# EAGLE design Mixer-Analog-OPA4134-Rev-L-multi (EAGLE 8.6.1)
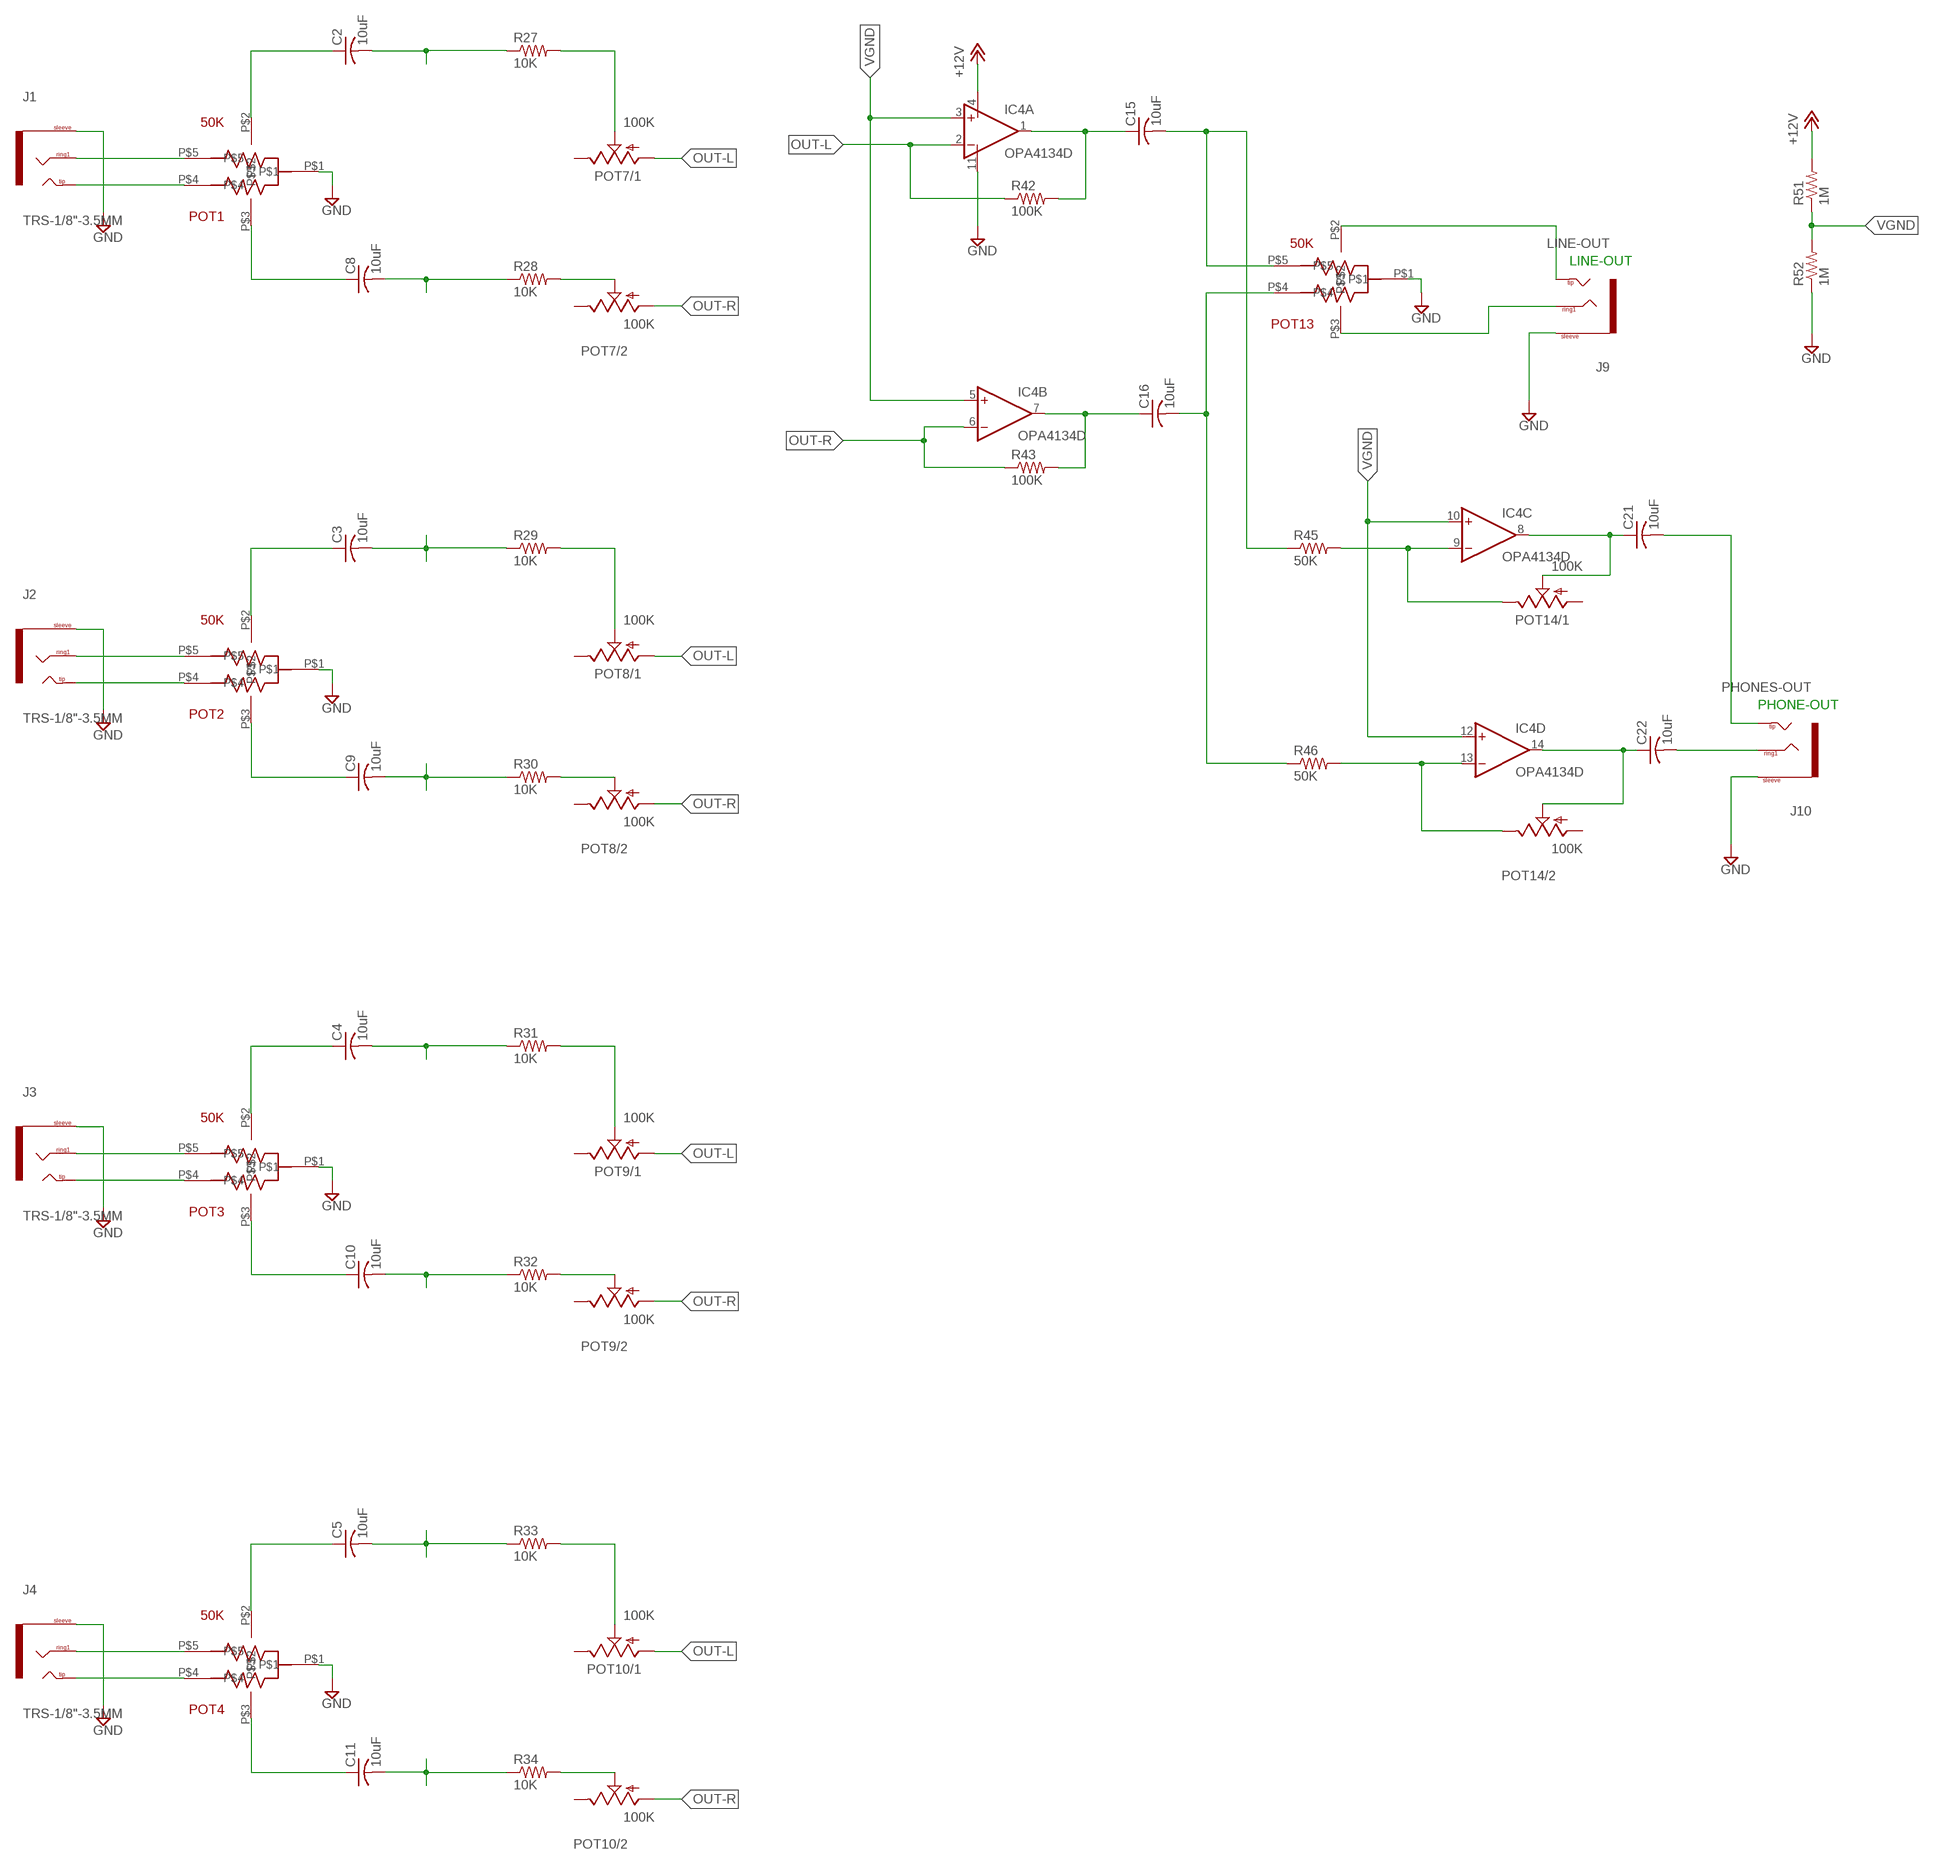
[diagram p0: schematic, sheet 1, part 1 of 2]
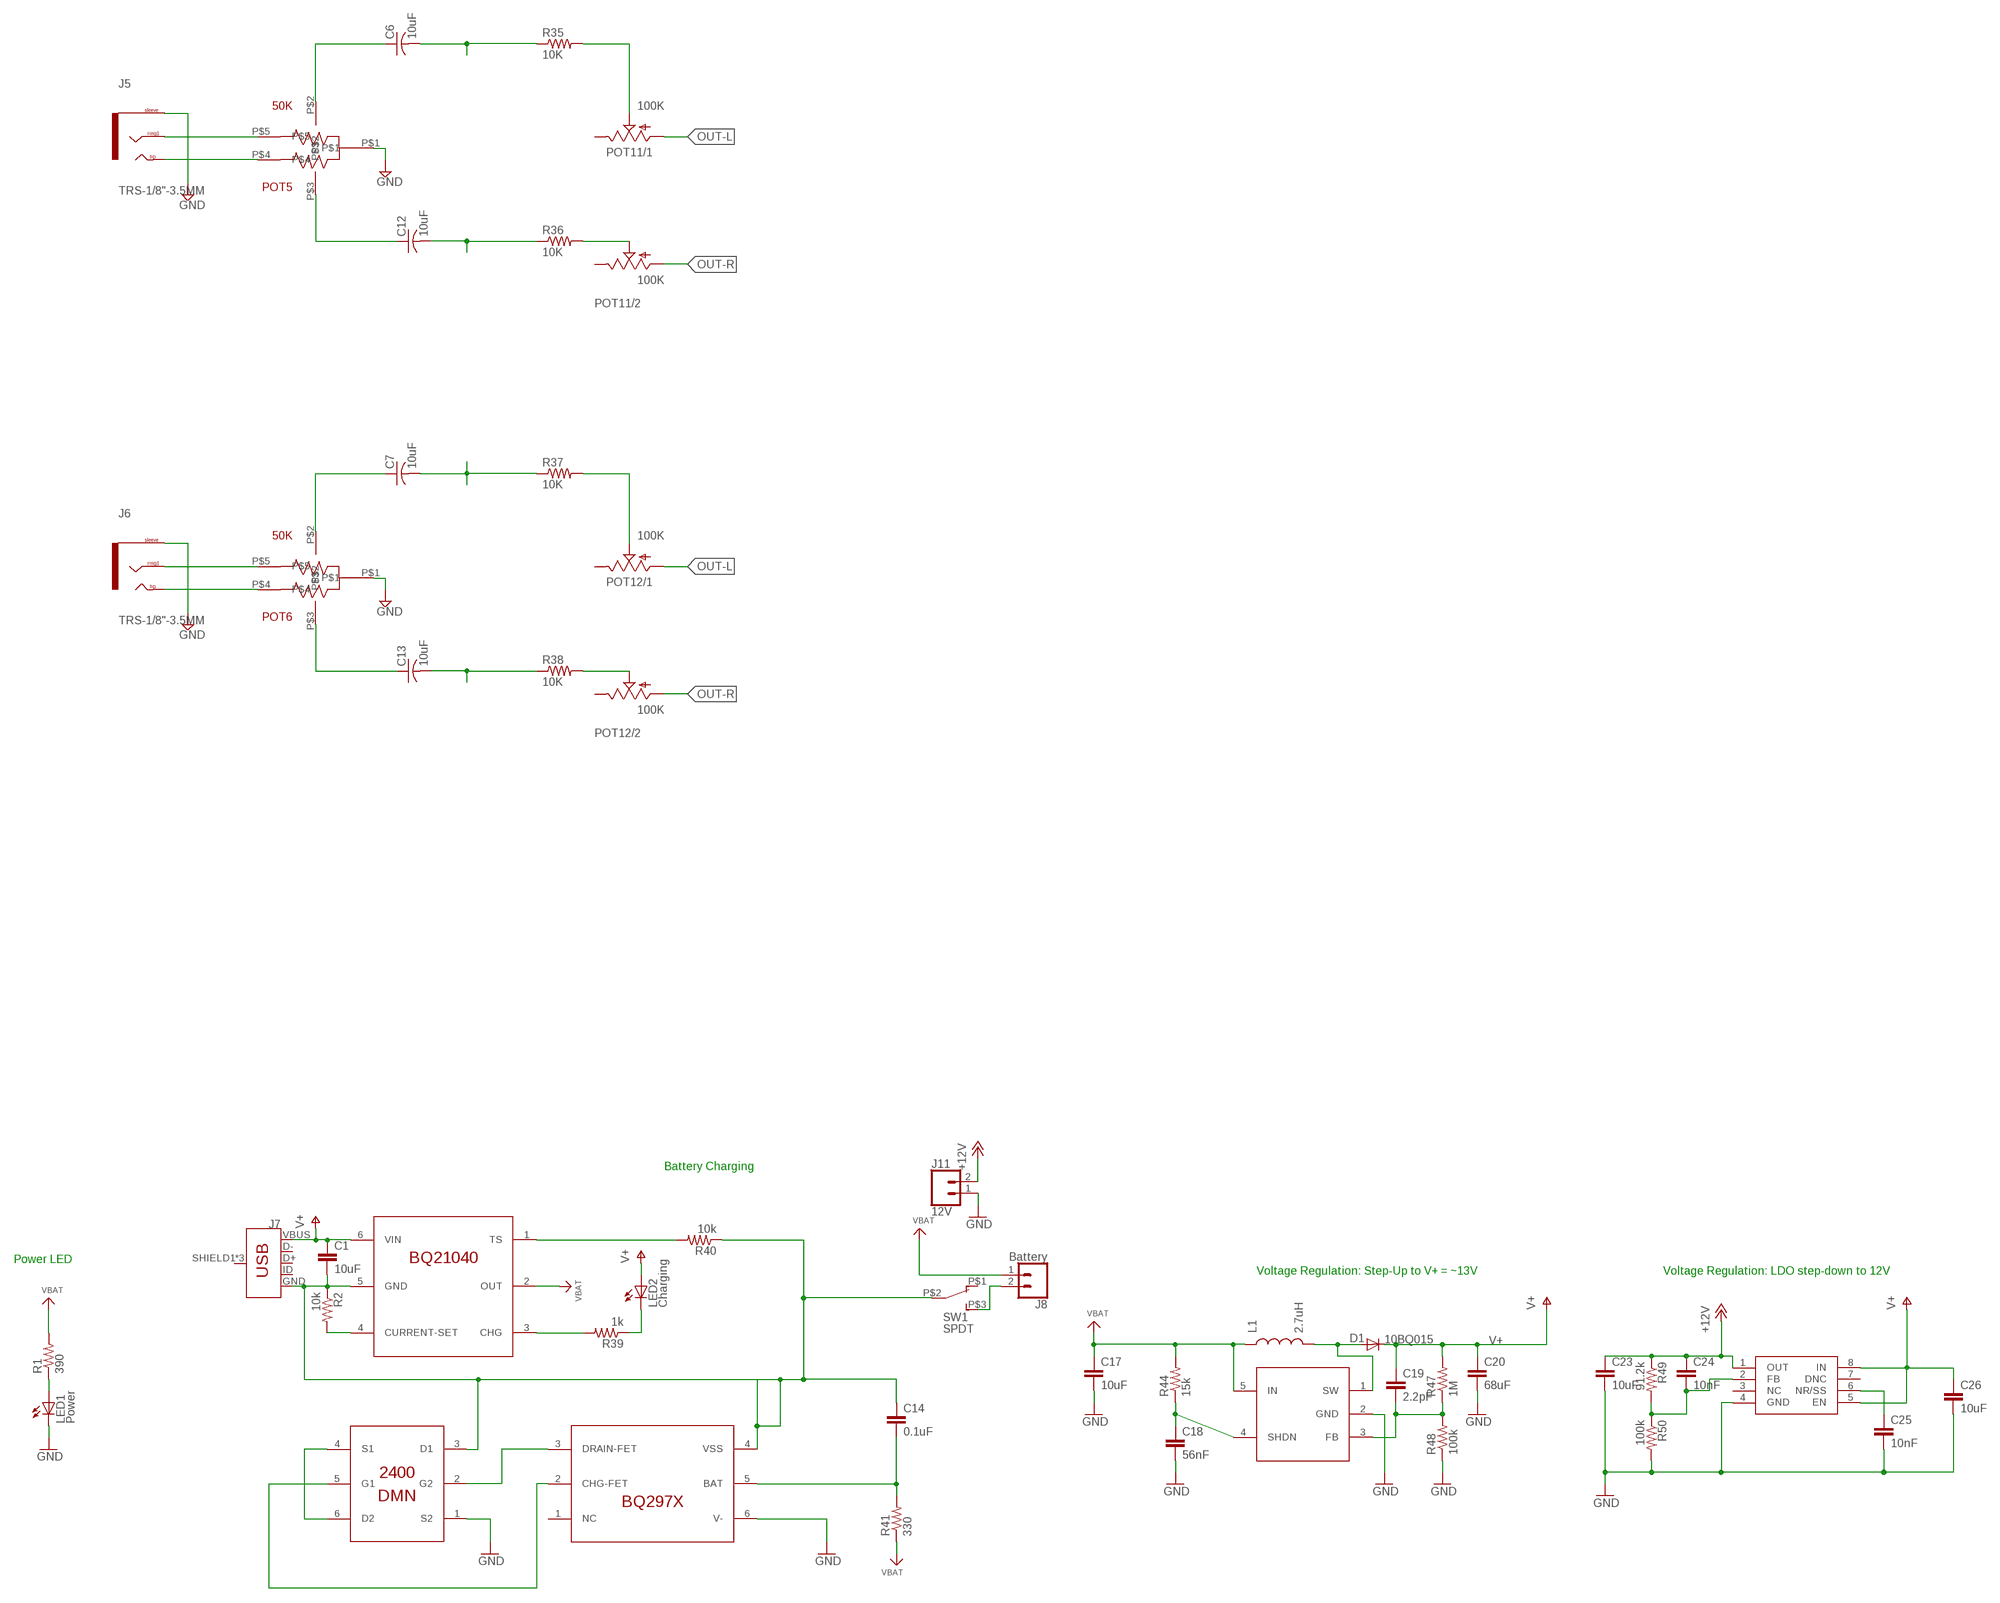
[diagram p1: schematic, sheet 1, part 2 of 2]

## Parts
C1  10uF  C-EUC0603  [C0603]
C2  10uF  C-USC0805K  [C0805K]
C3  10uF  C-USC0805K  [C0805K]
C4  10uF  C-USC0805K  [C0805K]
C5  10uF  C-USC0805K  [C0805K]
C6  10uF  C-USC0805K  [C0805K]
C7  10uF  C-USC0805K  [C0805K]
C8  10uF  C-USC0805K  [C0805K]
C9  10uF  C-USC0805K  [C0805K]
C10  10uF  C-USC0805K  [C0805K]
C11  10uF  C-USC0805K  [C0805K]
C12  10uF  C-USC0805K  [C0805K]
C13  10uF  C-USC0805K  [C0805K]
C14  0.1uF  C-EUC0603  [C0603]
C15  10uF  C-USC0805K  [C0805K]
C16  10uF  C-USC0805K  [C0805K]
C17  10uF  C-EUC0603  [C0603]
C18  56nF  C-EUC0603  [C0603]
C19  2.2pF  C-EUC0603  [C0603]
C20  68uF  C-EUC1206  [C1206]
C21  10uF  C-USC0805K  [C0805K]
C22  10uF  C-USC0805K  [C0805K]
C23  10uF  C-EUC0603  [C0603]
C24  10nF  C-EUC0603  [C0603]
C25  10nF  C-EUC0603  [C0603]
C26  10uF  C-EUC0603  [C0603]
D1  10BQ015  DIODESMA  [SMA-DIODE]
IC1  DMN2400  DUAL-NFET-DMN2400  [SOT-563]
IC2  BQ21040  BQ21040-LIPO-CHARGER  [SOT23-6]
IC3  BQ297X  BQ297X-BATTERY-MANAGER  [WSON-6]
IC4  OPA4134D  [SO14]
IC5  SC4503  [SOT23-5]
IC6  TPS7A49  [MSOP-8]
J1  TRS-1/8"-3.5MM  [TRS_SJ-3524-SMT]
J2  TRS-1/8"-3.5MM  [TRS_SJ-3524-SMT]
J3  TRS-1/8"-3.5MM  [TRS_SJ-3524-SMT]
J4  TRS-1/8"-3.5MM  [TRS_SJ-3524-SMT]
J5  TRS-1/8"-3.5MM  [TRS_SJ-3524-SMT]
J6  TRS-1/8"-3.5MM  [TRS_SJ-3524-SMT]
J7  USB_MICRO-BREDUCED_PASTE  [USB-B-MICRO-SMD_RED_PASTE]
J8  Battery  CONN_02LOCK  [1X02_LOCK]
J9  LINE-OUT  TRS-1/8"-3.5MM  [TRS_SJ-3524-SMT]
J10  PHONES-OUT  TRS-1/8"-3.5MM  [TRS_SJ-3524-SMT]
J11  12V  CONN_02LOCK  [1X02_LOCK]
L1  2.7uH  INDUCTORCR54-KIT  [CR54-KIT]
LED1  Power  LED3MM  [LED3MM]
LED2  Charging  LED3MM  [LED3MM]
POT1  50K  POT-DUAL-ALPS-RK10J12E0A0A  [POT-DUAL-ALPS-RK10J12E0A0A]
POT2  50K  POT-DUAL-ALPS-RK10J12E0A0A  [POT-DUAL-ALPS-RK10J12E0A0A]
POT3  50K  POT-DUAL-ALPS-RK10J12E0A0A  [POT-DUAL-ALPS-RK10J12E0A0A]
POT4  50K  POT-DUAL-ALPS-RK10J12E0A0A  [POT-DUAL-ALPS-RK10J12E0A0A]
POT5  50K  POT-DUAL-ALPS-RK10J12E0A0A  [POT-DUAL-ALPS-RK10J12E0A0A]
POT6  50K  POT-DUAL-ALPS-RK10J12E0A0A  [POT-DUAL-ALPS-RK10J12E0A0A]
POT7  100K  POT-DUAL-PTV112-4420  [PTV112]
POT8  100K  POT-DUAL-PTV112-4420  [PTV112]
POT9  100K  POT-DUAL-PTV112-4420  [PTV112]
POT10  100K  POT-DUAL-PTV112-4420  [PTV112]
POT11  100K  POT-DUAL-PTV112-4420  [PTV112]
POT12  100K  POT-DUAL-PTV112-4420  [PTV112]
POT13  50K  POT-DUAL-ALPS-RK10J12E0A0A  [POT-DUAL-ALPS-RK10J12E0A0A]
POT14  100K  POT-DUAL-PTV112-4420  [PTV112]
R1  390  R-US_R0603  [R0603]
R2  10k  R-US_R0603  [R0603]
R27  10K  RESISTOR0603-RES  [0603-RES]
R28  10K  RESISTOR0603-RES  [0603-RES]
R29  10K  RESISTOR0603-RES  [0603-RES]
R30  10K  RESISTOR0603-RES  [0603-RES]
R31  10K  RESISTOR0603-RES  [0603-RES]
R32  10K  RESISTOR0603-RES  [0603-RES]
R33  10K  RESISTOR0603-RES  [0603-RES]
R34  10K  RESISTOR0603-RES  [0603-RES]
R35  10K  RESISTOR0603-RES  [0603-RES]
R36  10K  RESISTOR0603-RES  [0603-RES]
R37  10K  RESISTOR0603-RES  [0603-RES]
R38  10K  RESISTOR0603-RES  [0603-RES]
R39  1k  R-US_R0603  [R0603]
R40  10k  R-US_R0603  [R0603]
R41  330  R-US_R0603  [R0603]
R42  100K  RESISTOR0603-RES  [0603-RES]
R43  100K  RESISTOR0603-RES  [0603-RES]
R44  15k  R-US_R0603  [R0603]
R45  50K  RESISTOR0603-RES  [0603-RES]
R46  50K  RESISTOR0603-RES  [0603-RES]
R47  1M  R-US_R0603  [R0603]
R48  100k  R-US_R0603  [R0603]
R49  91.2k  R-US_R0603  [R0603]
R50  100k  R-US_R0603  [R0603]
R51  1M  RESISTOR0603-RES  [0603-RES]
R52  1M  RESISTOR0603-RES  [0603-RES]
SW1  SPDT  SWITCH_SPDTCL-SB-12B  [SWITCH_SPDT_CL-SB-12B]

## Nets
+12V: C23.1 C24.1 IC4.4(P:V+) IC6.1(OUT) J11.2 R49.1 R51.2
GND: C17.2 C18.2 C20.2 C23.2 C25.2 C26.2 IC1.1(S2) IC3.6(V-) IC4.11(P:V-) IC6.4(GND) J1.1(SLEEVE) J2.1(SLEEVE) J3.1(SLEEVE) J4.1(SLEEVE) J5.1(SLEEVE) J6.1(SLEEVE) J9.1(SLEEVE) J10.1(SLEEVE) J11.1 LED1.K(C) POT1.P$1 POT2.P$1 POT3.P$1 POT4.P$1 POT5.P$1 POT6.P$1 POT13.P$1 R48.1 R50.2 R52.1
GND1: C1.2 C14.1 IC1.3(D1) IC2.5(GND) IC3.4(VSS) J7.GND R2.1 R40.1 SW1.P$2
N$1: C8.1 POT1.P$3
N$2: J8.2 SW1.P$3
N$3: C8.2 R28.1
N$5: J1.3(RING1) POT1.P$5
N$7: C15.1 IC4.1(A:OUT) R42.2
N$8: C2.1 POT1.P$2
N$9: J1.2(TIP) J1.4(TIP) POT1.P$4
N$13: C2.2 R27.1
N$15: IC4.13(D:-IN) POT14.2.3(/2:E) R46.2
N$16: J9.2(TIP) J9.4(TIP) POT13.P$2
N$17: C16.1 IC4.7(B:OUT) R43.2
N$18: J9.3(RING1) POT13.P$3
N$19: POT7.2.2(/2:S) R28.2
N$21: C22.2 J10.3(RING1)
N$22: C9.2 R30.1
N$23: C21.2 J10.2(TIP) J10.4(TIP)
N$24: C21.1 IC4.8(C:OUT) POT14.1.2(/1:S)
N$25: C22.1 IC4.14(D:OUT) POT14.2.2(/2:S)
N$26: J2.3(RING1) POT2.P$5
N$27: POT8.1.2(/1:S) R29.2
N$28: C9.1 POT2.P$3
N$29: C3.1 POT2.P$2
N$30: J2.2(TIP) J2.4(TIP) POT2.P$4
N$31: C3.2 R29.1
N$32: POT8.2.2(/2:S) R30.2
N$41: C10.2 R32.1
N$42: J3.3(RING1) POT3.P$5
N$43: POT9.1.2(/1:S) R31.2
N$44: C10.1 POT3.P$3
N$45: C4.1 POT3.P$2
N$46: J3.2(TIP) J3.4(TIP) POT3.P$4
N$47: C4.2 R31.1
N$48: POT9.2.2(/2:S) R32.2
N$55: POT7.1.2(/1:S) R27.2
N$58: C11.2 R34.1
N$59: J4.3(RING1) POT4.P$5
N$60: POT10.1.2(/1:S) R33.2
N$61: C15.2 POT13.P$5 R45.1
N$62: C11.1 POT4.P$3
N$63: C5.1 POT4.P$2
N$64: J4.2(TIP) J4.4(TIP) POT4.P$4
N$65: C5.2 R33.1
N$66: POT10.2.2(/2:S) R34.2
N$75: C12.2 R36.1
N$76: J5.3(RING1) POT5.P$5
N$77: POT11.1.2(/1:S) R35.2
N$78: C12.1 POT5.P$3
N$79: C6.1 POT5.P$2
N$80: J5.2(TIP) J5.4(TIP) POT5.P$4
N$81: C6.2 R35.1
N$82: POT11.2.2(/2:S) R36.2
N$91: C13.2 R38.1
N$92: J6.3(RING1) POT6.P$5
N$93: POT12.1.2(/1:S) R37.2
N$94: C13.1 POT6.P$3
N$95: C7.1 POT6.P$2
N$96: J6.2(TIP) J6.4(TIP) POT6.P$4
N$97: C7.2 R37.1
N$98: POT12.2.2(/2:S) R38.2
N$114: LED1.A R1.1
N$115: D1.A IC5.1(SW) L1.P$2
N$116: C18.1 IC5.4(SHDN) R44.1
N$117: C19.2 IC5.3(FB) R47.1 R48.2
N$118: C24.2 IC6.2(FB) R49.2 R50.1
N$119: C25.1 IC6.6(NR/SS)
N$121: LED2.K(C) R39.1
N$122: IC2.3(CHG) R39.2
N$123: IC2.1(TS) R40.2
N$124: IC2.4(CURRENT-SET) R2.2
N$125: C14.2 IC3.5(BAT) R41.2
N$126: IC1.4(S1) IC1.6(D2)
N$127: IC1.5(G1) IC3.2(CHG-FET)
N$128: IC1.2(G2) IC3.3(DRAIN-FET)
OUT-L: IC4.2(A:-IN) POT7.1.1(/1:A) POT8.1.1(/1:A) POT9.1.1(/1:A) POT10.1.1(/1:A) POT11.1.1(/1:A) POT12.1.1(/1:A) R42.1
OUT-L1: IC4.9(C:-IN) POT14.1.3(/1:E) R45.2
OUT-R: IC4.6(B:-IN) POT7.2.1(/2:A) POT8.2.1(/2:A) POT9.2.1(/2:A) POT10.2.1(/2:A) POT11.2.1(/2:A) POT12.2.1(/2:A) R43.1
OUT-R1: C16.2 POT13.P$4 R46.1
V+: C1.1 C19.1 C20.1 C26.1 D1.C IC2.6(VIN) IC6.5(EN) IC6.8(IN) J7.VBUS LED2.A R47.2
VBAT: C17.1 IC2.2(OUT) IC5.5(IN) J8.1 L1.P$1 R1.2 R41.1 R44.2
VGND: IC4.3(A:+IN) IC4.5(B:+IN) IC4.10(C:+IN) IC4.12(D:+IN) R51.1 R52.2
Unconnected: IC3.1(NC) IC5.2(GND) IC6.3(NC) IC6.7(DNC) J7.D+ J7.D- J7.ID J7.SHIELD1(SHIELD) J7.SHIELD2(SHIELD) J7.SHIELD3(SHIELD) POT7.1.3(/1:E) POT7.2.3(/2:E) POT8.1.3(/1:E) POT8.2.3(/2:E) POT9.1.3(/1:E) POT9.2.3(/2:E) POT10.1.3(/1:E) POT10.2.3(/2:E) POT11.1.3(/1:E) POT11.2.3(/2:E) POT12.1.3(/1:E) POT12.2.3(/2:E) POT14.1.1(/1:A) POT14.2.1(/2:A) SW1.P$1

## Notes on the sheet
- LINE-OUT
- PHONE-OUT
- Battery Charging
- Power LED
- Voltage Regulation: Step-Up to V+ = ~13V | Voltage Regulation: LDO step-down to 12V

## Library data of the parts
C1 C14 C17-C20 C23-C26 = rcl:C-EU: CAPACITOR, European symbol; SPICEPREFIX: C
C2-C13 C15 C16 C21 C22 = adafruit:C-US: CAPACITOR, American symbol
D1 = SparkFun:DIODE: Diode These are standard reverse protection diodes and small signal diodes. SMA package can handle up to about 1A. SOD-323 can handle about 200mA. What the SOD-323 package when ordering, there are some mfgs out there that are 5-pin packages.
IC1 = CMU-ArtFab:DUAL-NFET-DMN2400
IC2 = CMU-ArtFab:BQ21040-LIPO-CHARGER
IC3 = CMU-ArtFab:BQ297X-BATTERY-MANAGER
IC4 = linear:OPA4134: SoundPLUS (TM) High Performance AUDIO OPERATIONAL AMPLIFIERS Source: http://focus.ti.com/lit/ds/sbos058/sbos058.pdf
IC5 = CMU-ArtFab:SC4503
IC6 = CMU-ArtFab:TPS7A49
J1-J6 J9 J10 = CMU-ArtFab:TRS-1/8"-3.5MM
J7 = SparkFun-Connectors:USB_MICRO-B: USB Type Micro-B Connector Male/female and PTH/SMT variants SparkFun Products: SparkFun microB USB Breakout <https://www.sparkfun.com/products/12035> SparkFun USB microB Plug Breakout <https://www.sparkfun.com/products/10031> SparkFun ESP8266 Thing <https://www.sparkfun.com/products/13231>; PROD_ID: CONN-11752
J8 J11 = SparkFun-Connectors:CONN_02: Multi connection point. Often used as Generic Header-pin footprint for 0.1 inch spaced/style header connections On any of the 0.1 inch spaced packages, you can populate with these: Break Away Headers - Straight <https://www.sparkfun.com/products/116> (PRT-00116) Break Away Male Headers - Right Angle <https://www.sparkfun.com/products/553> (PRT-00553) Female Headers <https://www.sparkfun.com/products/115> (PRT-00115) Break Away Headers - Machine Pin <https://www.sparkfun.com/products/117> (PRT-00117) Break Away Female Headers - Swiss Machine Pin <https://www.sparkfun.com/products/743> (PRT-00743) For SCREWTERMINALS and SPRING TERMINALS visit here: Screw Terimnals on SparkFun.com <https://www.sparkfun.com/search/results?term=Screw+Terminals> (5mm/3.5mm/2.54mm spacing) This device is also useful as a general connection point to wire up your design to another part of your project. Our various solder wires solder well into these plated through hole pads. Hook-Up Wire - Assortment (Stranded, 22 AWG) <https://www.sparkfun.com/products/11375> (PRT-11375) Hook-Up Wire - Assortment (Solid Core, 22 AWG) <https://www.sparkfun.com/products/11367> (PRT-11367) View the entire wire category on our website here <https://www.sparkfun.com/categories/141> Special notes: Molex polarized connector foot print use with: PRT-08233 with associated crimp pins and housings. 2.54_SCREWTERM for use with PRT-10571. 3.5mm Screw Terminal footprints for PRT-08084 5mm Screw Terminal footprints for use with PRT-08432
L1 = SparkFun-Passives:INDUCTOR: Inductors Basic Inductor/Choke - 0603 and 1206. Footprints are not proven and vary greatly between part numbers. SRN6045- 33uH, 20% 1.4A SDR0403-560KL - 56uH, 10%, 500mA RMS/740mA peak
LED1 LED2 = led:LED: LED OSRAM: - CHIPLED LG R971, LG N971, LY N971, LG Q971, LY Q971, LO R971, LY R971 LH N974, LH R974 LS Q976, LO Q976, LY Q976 LO Q996 - Hyper CHIPLED LW Q18S LB Q993, LB Q99A, LB R99A - SideLED LS A670, LO A670, LY A670, LG A670, LP A670 LB A673, LV A673, LT A673, LW A673 LH A674 LY A675 LS A676, LA A676, LO A676, LY A676, LW A676 LS A679, LY A679, LG A679 - Hyper Micro SIDELED® LS Y876, LA Y876, LO Y876, LY Y876 LT Y87S - SmartLED LW L88C, LW L88S LB L89C, LB L89S, LG L890 LS L89K, LO L89K, LY L89K LS L896, LA L896, LO L896, LY L896 - TOPLED LS T670, LO T670, LY T670, LG T670, LP T670 LSG T670, LSP T670, LSY T670, LOP T670, LYG T670 LG T671, LOG T671, LSG T671 LB T673, LV T673, LT T673, LW T673 LH T674 LS T676, LA T676, LO T676, LY T676, LB T676, LH T676, LSB T676, LW T676 LB T67C, LV T67C, LT T67C, LS T67K, LO T67K, LY T67K, LW E67C LS E67B, LA E67B, LO E67B, LY E67B, LB E67C, LV E67C, LT E67C LW T67C LS T679, LY T679, LG T679 LS T770, LO T770, LY T770, LG T770, LP T770 LB T773, LV T773, LT T773, LW T773 LH T774 LS E675, LA E675, LY E675, LS T675 LS T776, LA T776, LO T776, LY T776, LB T776 LHGB T686 LT T68C, LB T68C - Hyper Mini TOPLED® LB M676 - Mini TOPLED Santana® LG M470 LS M47K, LO M47K, LY M47K Source: http://www.osram.convergy.de LUXEON: - LUMILED® LXK2-PW12-R00, LXK2-PW12-S00, LXK2-PW14-U00, LXK2-PW14-V00 LXK2-PM12-R00, LXK2-PM12-S00, LXK2-PM14-U00 LXK2-PE12-Q00, LXK2-PE12-R00, LXK2-PE12-S00, LXK2-PE14-T00, LXK2-PE14-U00 LXK2-PB12-K00, LXK2-PB12-L00, LXK2-PB12-M00, LXK2-PB14-N00, LXK2-PB14-P00, LXK2-PB14-Q00 LXK2-PR12-L00, LXK2-PR12-M00, LXK2-PR14-Q00, LXK2-PR14-R00 LXK2-PD12-Q00, LXK2-PD12-R00, LXK2-PD12-S00 LXK2-PH12-R00, LXK2-PH12-S00 LXK2-PL12-P00, LXK2-PL12-Q00, LXK2-PL12-R00 Source: www.luxeon.com KINGBRIGHT: KA-3528ASYC Source: www.kingbright.com
POT1-POT6 POT13 = CMU-ArtFab:POT-DUAL-ALPS-RK10J12E0A0A
POT7-POT12 POT14 = CMU-ArtFab:POT-DUAL-PTV112: Bourns 11mm dual potentiometer; AVAILABILITY: Unavailable; DESCRIPTION: Alt# Tce-10111410; MF: STMicroelectronics; MP: PTV112; PACKAGE: None; PRICE: None; SPICEPREFIX: J
R1 R2 R39-R41 R44 R47-R50 = CMU-ArtFab:R-US_: RESISTOR, American symbol
R27-R38 R42 R43 R45 R46 = SparkFun-Passives:RESISTOR: Resistor Basic schematic elements and footprints for 0603, 1206, and PTH resistors.; SPICEPREFIX: R
R51 R52 = SparkFun-Passives:RESISTOR: Resistor Basic schematic elements and footprints for 0603, 1206, and PTH resistors.
SW1 = CMU-ArtFab:SWITCH_SPDT

## Board
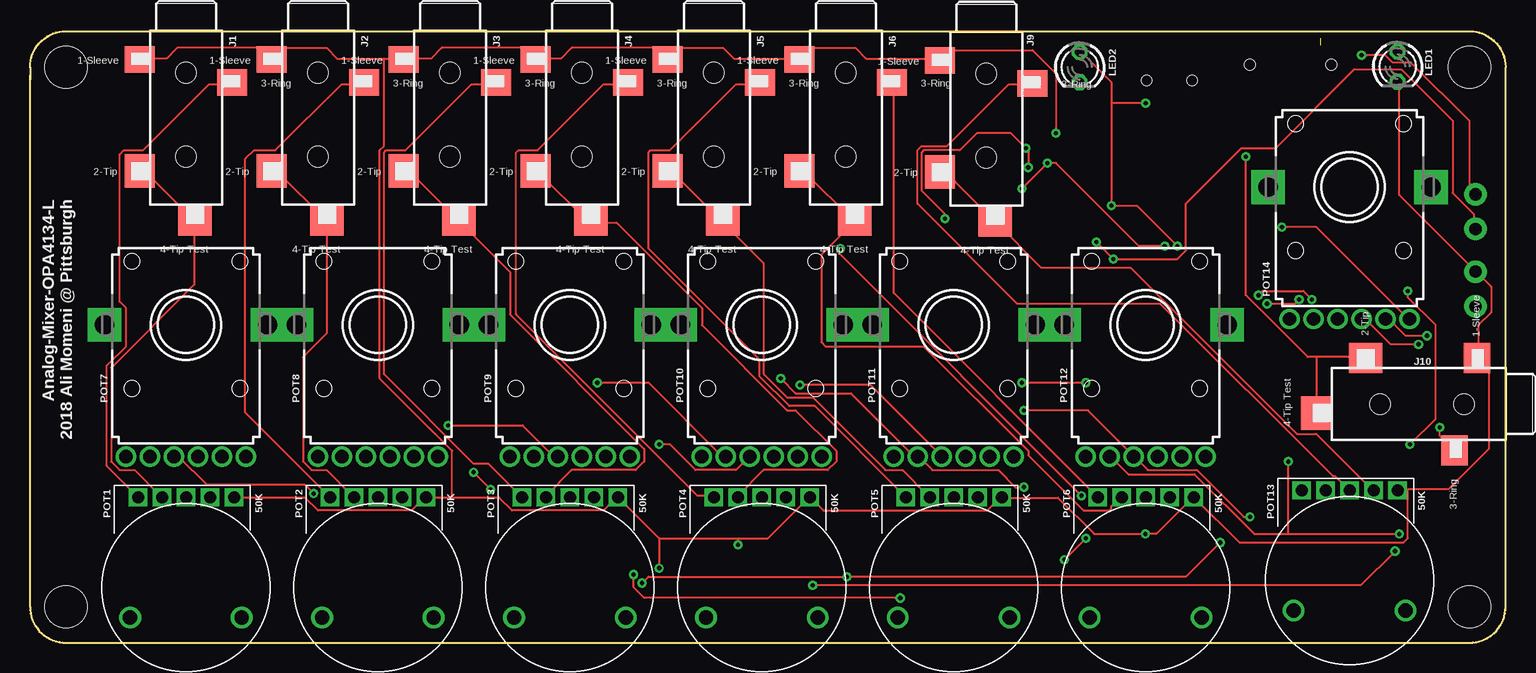
[diagram p2: board, top side]
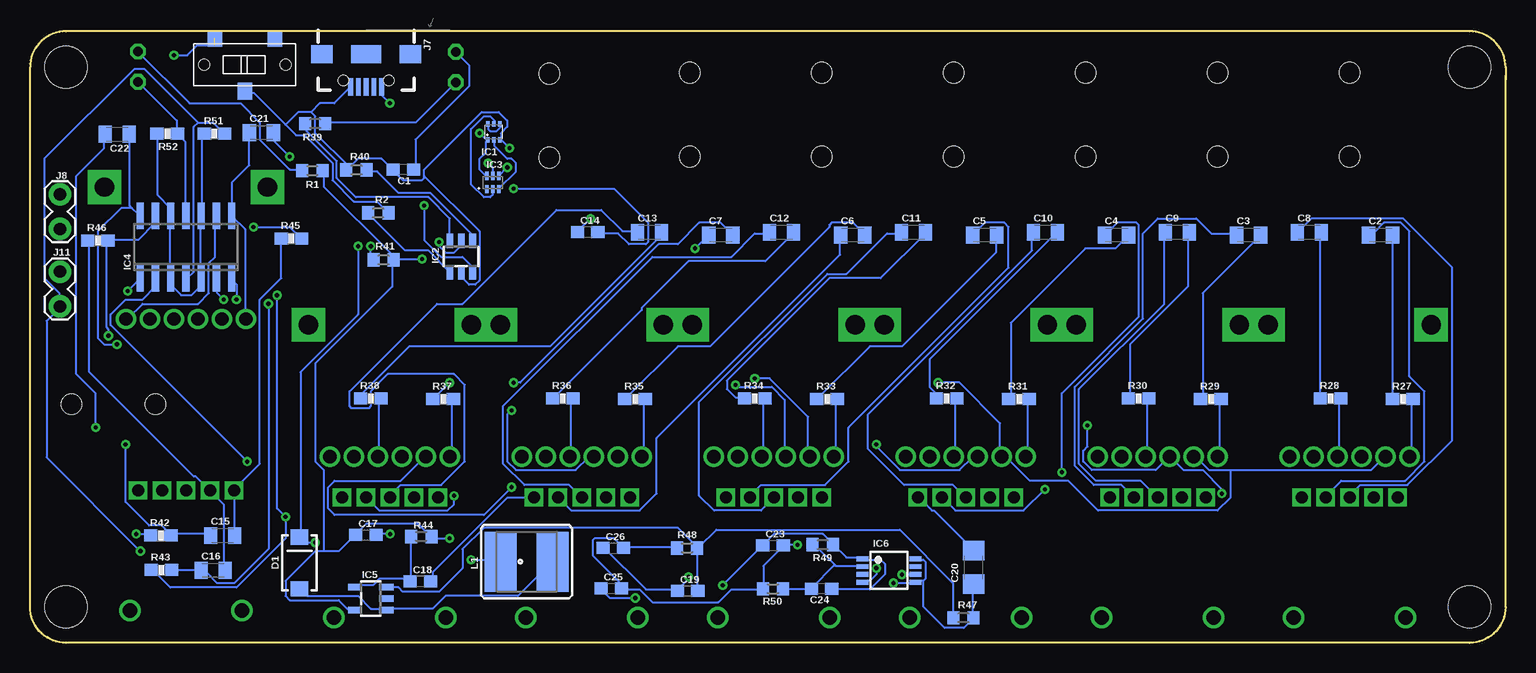
[diagram p3: board, bottom side, seen from below]

Size 123 x 51 mm. Coordinates in mm from the lower left corner, seen from the top.
Outline: 0,47 0,47.3
Outline: 0,47 0,48 arc-90 3,51 120,51 arc-90 123,48 123,3 arc-90 120,0 3,0 arc-90 0,3 0,47
Copper layers (1*16): Top 0.035mm / dielectric 1.5mm / Bottom 0.035mm
Design rules "default *": minimum track width 6mil, minimum drill 0.35mm, track to track 8mil, track to pad 8mil, pad to pad 8mil, via to via 8mil, smd to smd 8mil, copper to edge 40mil, drill to drill 6mil, minimum pad ring 10mil, minimum via ring 8mil, stop-mask expansion 4mil, vias tented up to drill 0mil, thermal gap 10mil
Holes 3.5 mm at 3,48 3,3 120,3 120,48

### Footprints (pad centres in the part's own frame; a part is rotated, then mirrored left to right if it is on the bottom)
C0603 = smd 1.1 x 1: 1 -0.85,0; 2 0.85,0
C0805K = smd 1.1 x 1.4: 1 -1,0; 2 1,0
C1206 = smd 1.6 x 1.8: 1 -1.4,0; 2 1.4,0
SMA-DIODE = smd 1.27 x 1.47: A -2.15,0; C 2.15,0
SOT-563 = smd 0.3 x 0.45: 1 -0.5,-0.675; 2 0,-0.675; 3 0.5,-0.675; 4 0.5,0.675; 5 0,0.675; 6 -0.5,0.675
SOT23-6 = smd 0.55 x 1.2: 1 -0.95,-1.3; 2 0,-1.3; 3 0.95,-1.3; 4 0.95,1.3; 5 0,1.3; 6 -0.95,1.3
WSON-6 = smd 0.3 x 0.7: 1 -0.5,-0.55; 2 0,-0.55; 3 0.5,-0.55; 4 0.5,0.55; 5 0,0.55; 6 -0.5,0.55
SO14 = smd 0.6 x 2.2: 1 -3.81,-2.6; 2 -2.54,-2.6; 3 -1.27,-2.6; 4 0,-2.6; 5 1.27,-2.6; 6 2.54,-2.6; 7 3.81,-2.6; 8 3.81,2.6; 9 2.54,2.6; 10 1.27,2.6; 11 0,2.6; 12 -1.27,2.6; 13 -2.54,2.6; 14 -3.81,2.6
SOT23-5 = smd 0.55 x 1.2: 1 -0.95,-1.3; 2 0,-1.3; 3 0.95,-1.3; 4 0.95,1.3; 5 -0.95,1.3
MSOP-8 = smd 0.4 x 1: 1 -0.975,-2.2; 2 -0.325,-2.2; 3 0.325,-2.2; 4 0.975,-2.2; 5 0.975,2.2; 6 0.325,2.2; 7 -0.325,2.2; 8 -0.975,2.2
TRS_SJ-3524-SMT = smd 2.5 x 2.2: 1 3.85,-4.6; 3 -3.85,-2.7 | smd 2.5 x 2.8: 2 3.85,4.7 | smd 2.8 x 2.5: 4 -0.75,8.85 | hole 1.7: 0,-3.5; 0,3.5
USB-B-MICRO-SMD_RED_PASTE = smd 1.45 x 0.4: D+ 2.725,0; D- 2.725,0.65; GND 2.725,-1.3; ID 2.725,-0.65; VBUS 2.725,1.3 | smd 1.5 x 1.8: SHIELD1 0,3.685; SHIELD2 0,-3.685 | smd 1.5 x 2.5: SHIELD3 0,0 | hole 0.85: 2.2,1.9; 2.2,-1.9
1X02_LOCK = drill 1.016 pad 1.88: 1 -0.178,0; 2 2.718,0
CR54-KIT = smd 5 x 2.65: P$1 0,2.17; P$2 0,-2.17
LED3MM = drill 0.813 octagon: A -1.27,0; K 1.27,0
POT-DUAL-ALPS-RK10J12E0A0A = drill 1 pad 1.321 square: P$1 -4,0; P$2 -2,0; P$3 0,0; P$4 2,0; P$5 4,0 | drill 1.2: P$6 4.65,10; P$7 -4.65,10
PTV112 = drill 1.1 pad 1.676: 1.1 -3,-11; 1.2 -5,-11; 1.3 5,-11; 2.1 -1,-11; 2.2 1,-11; 2.3 3,-11 | drill 1.6 pad 2.8 square: M1 -6.8,0; M2 6.8,0
R0603 = smd 1 x 1.1: 1 -0.85,0; 2 0.85,0
0603-RES = smd 1.1 x 1: 1 -0.85,0; 2 0.85,0
SWITCH_SPDT_CL-SB-12B = smd 1.2 x 1.4: P$1 -2.5,-2.2; P$2 0,2.2; P$3 2.5,-2.2 | hole 0.9: -3.4,0; 3.4,0

### Placement (x,y rotation side)
C1  91.88,39.46 180 bottom
C2  10.42,34 0 bottom
C3  21.42,34 0 bottom
C4  32.42,34 0 bottom
C5  43.42,34 0 bottom
C6  54.42,34 0 bottom
C7  65.42,34 0 bottom
C8  16.35,34.23 0 bottom
C9  27.35,34.23 0 bottom
C10  38.35,34.23 0 bottom
C11  49.35,34.23 0 bottom
C12  60.35,34.23 0 bottom
C13  71.35,34.23 0 bottom
C14  76.51,34.27 0 bottom
C15  106.94,8.94 0 bottom
C16  107.73,6.04 0 bottom
C17  95,9 0 bottom
C18  90.46,5.14 0 bottom
C19  68.18,4.33 0 bottom
C20  44.33,6.29 90 bottom
C21  103.71,42.54 0 bottom
C22  115.73,42.41 180 bottom
C23  61.06,8.13 0 bottom
C24  57.01,4.52 180 bottom
C25  74.55,4.54 0 bottom
C26  74.38,7.9 0 bottom
D1  100.53,6.66 90 bottom
IC1  84.34,42.61 0 bottom
IC2  87.06,32.21 180 bottom
IC3  84.43,38.39 0 bottom
IC4  110,33 0 bottom
IC5  94.59,3.69 90 bottom
IC6  51.39,6.03 270 bottom
J1  [TRS_SJ-3524-SMT]  13,44.04 180 top
J2  [TRS_SJ-3524-SMT]  24,44.04 180 top
J3  [TRS_SJ-3524-SMT]  35,44.04 180 top
J4  [TRS_SJ-3524-SMT]  46,44.04 180 top
J5  [TRS_SJ-3524-SMT]  57,44.04 180 top
J6  [TRS_SJ-3524-SMT]  68,44.04 180 top
J7  94.98,49.09 270 bottom
J8  120.5,34.68 90 bottom
J9  79.72,43.96 180 top
J10  116.04,19.9 90 top
J11  120.5,30.77 270 bottom
L1  81.6,6.77 90 bottom
LED1  114,48.05 270 top
LED2  87.5,48.01 270 top
POT1  13,12.12 180 top
POT2  29,12.12 180 top
POT3  45,12.12 180 top
POT4  61,12.12 180 top
POT5  77,12.12 180 top
POT6  93,12.12 180 top
POT7  13,26.52 0 top
POT8  29,26.52 0 top
POT9  45,26.52 0 top
POT10  61,26.52 0 top
POT11  77,26.52 0 top
POT12  93,26.52 0 top
POT13  110,12.7 180 top
POT14  110,38 0 top
R1  99.46,39.37 0 bottom
R2  93.97,35.85 180 bottom
R27  8.56,20.33 0 bottom
R28  14.59,20.38 0 bottom
R29  24.56,20.33 0 bottom
R30  30.59,20.38 0 bottom
R31  40.56,20.33 0 bottom
R32  46.59,20.38 0 bottom
R33  56.56,20.33 0 bottom
R34  62.59,20.38 0 bottom
R35  72.56,20.33 0 bottom
R36  78.59,20.38 0 bottom
R37  88.56,20.33 0 bottom
R38  94.59,20.38 0 bottom
R39  99.23,43.3 180 bottom
R40  95.78,39.44 0 bottom
R41  93.52,31.93 180 bottom
R42  112.1,8.94 0 bottom
R43  112.04,6.07 0 bottom
R44  90.38,8.86 0 bottom
R45  101.2,33.72 0 bottom
R46  117.35,33.55 0 bottom
R47  45.19,2.1 0 bottom
R48  68.23,7.9 0 bottom
R49  56.91,8.18 180 bottom
R50  61.06,4.5 180 bottom
R51  107.61,42.46 0 bottom
R52  111.56,42.44 180 bottom
SW1  105.09,48.21 180 bottom

### Tracks (layer width: path | path; a pad name or v marks a point on that pad's centre or on a via)
+12V  (via drill 0.35)
  Top 0.152: v65.25,4.8 110.95,4.8 v113.79,7.64
  Bottom 0.152: C24.1 56.01,4.45 52.98,4.45 51.74,5.69 51.74,6.58 52.09,6.93 53.52,6.93 IC6.1 53.7,7.11 54.94,7.11 56.01,8.18 R49.1 56.19,8.36 56.9,9.07 60.98,9.07 61.87,8.18 C23.1 62.05,8 v65.25,4.8 | 108.99,43.38 107.75,43.38 106.86,42.49 R51.2 | 108.99,43.38 109.35,43.03 109.35,30.94 109.88,30.4 IC4.4 | 108.99,43.38 113.44,47.83 114.33,47.83 121.79,40.36 121.79,30.4 120.55,29.16 120.55,28.09 J11.2 120.55,27.91 121.61,26.85 121.61,15.47 v113.79,7.64
GND  (via drill 0.35)
  Top 0.152: J1.1 9.25,48.72 11.38,48.72 12.27,49.61 19.2,49.61 20.09,48.72 J2.1 20.27,48.72 21.16,49.61 24.71,49.61 25.6,48.72 29.52,48.72 | 29.52,48.72 31.11,48.72 J3.1 31.29,48.72 33.43,48.72 34.31,49.61 41.25,49.61 42.14,48.72 J4.1 42.32,48.72 44.27,48.72 45.16,49.61 52.09,49.61 52.98,48.72 J5.1 53.16,48.72 54.05,49.61 57.78,49.61 58.67,48.72 64.01,48.72 J6.1 64.19,48.72 65.08,49.61 68.81,49.61 69.7,48.72 75.74,48.72 J9.1 75.92,48.72 76.63,49.43 83.57,49.43 85.52,47.47 v85.52,42.49 | 114.86,12.8 118.24,12.8 121.61,16.18 121.61,22.76 120.73,23.65 J10.1 120.73,23.82 120.73,26.49 121.79,27.56 121.79,29.69 120.55,30.94 J11.1 120.37,31.11 114.15,37.34 114.15,46.76 LED1.K | 114.86,12.8 114.15,12.8 POT13.P$1 | POT1.P$1 17.07,12.09 22.94,12.09 24,11.02 31.83,11.02 32.89,12.09 POT2.P$1 33.07,12.09 35.2,12.09 | 52.45,8.71 v52.45,6.22 | 52.45,8.71 49.07,12.09 POT3.P$1 48.9,12.09 47.83,11.02 40.18,11.02 39.12,12.09 35.2,12.09 | 52.45,8.71 59.03,8.71 | 59.03,8.71 61.52,8.71 64.9,12.09 POT4.P$1 65.08,12.09 66.14,11.02 79.83,11.02 80.9,12.09 POT5.P$1 81.08,12.09 85.7,12.09 88.72,9.07 v92.99,9.07 93.88,9.07 96.9,12.09 POT6.P$1 97.08,12.09 100.81,8.36 114.5,8.36 114.86,8.71 114.86,12.8 | 59.03,8.71 v59.03,8.18 | 29.52,48.72 29.52,41.43 29.16,41.07 29.16,22.05 35.2,16 35.2,12.09
  Bottom 0.152: IC3.6 84.99,38.94 85.52,39.47 85.52,40.36 84.99,40.89 84.99,41.78 IC1.1 84.99,41.96 v85.52,42.49 | LED1.K 113.97,46.76 110.77,43.56 110.77,42.49 R52.1 110.59,42.32 110.06,41.78 110.06,35.74 IC4.11 | v92.99,9.07 94.06,9.07 C17.2 | C18.2 89.43,5.16 89.43,5.87 83.21,12.09 81.08,12.09 POT5.P$1 | R48.1 69.16,8 73.43,8 C26.2 73.61,8 74.32,8.71 75.92,8.71 76.1,8.53 76.1,7.29 73.79,4.98 73.79,4.62 C25.2 73.61,4.45 72.19,4.45 71.12,3.38 65.61,3.38 64.54,4.45 62.05,4.45 R50.2 61.87,4.62 61.87,6.4 60.27,8 C23.2 60.1,8.18 v59.03,8.18 | v52.45,6.22 52.45,5.69 52.98,5.16 53.52,5.16 IC6.4 | C20.2 44.45,7.82 47.65,11.02 47.83,11.02 48.9,12.09 POT3.P$1
GND1  (via drill 0.35)
  Top 0.152: v83.21,39.65 83.21,41.07 v83.03,41.25 81.79,42.49 78.94,42.49 77.52,41.07 74.5,41.07 74.32,40.89 74.32,37.69 76.28,35.74 v76.28,35.38
  Bottom 0.152: 101.7,43.2 104.37,45.87 105.08,45.87 SW1.P$2 | 101.7,43.2 100.81,42.32 100.1,42.32 97.79,40.01 97.79,38.58 96.01,36.8 94.06,36.8 93.17,35.92 R2.1 | 83.74,41.96 83.74,42.49 83.21,43.03 83.21,43.56 83.92,44.27 85.34,44.27 90.14,39.47 90.14,38.94 | 90.14,38.94 90.14,38.76 90.32,38.58 91.92,38.58 92.63,39.29 C1.2 92.81,39.47 93.7,40.36 95.66,40.36 96.37,39.65 | v83.21,39.65 IC3.4 | 83.74,41.96 v83.03,41.25 | 83.74,41.96 IC1.3 | v76.28,35.38 77.34,34.31 C14.1 | 96.37,39.65 96.55,39.47 R40.1 96.37,39.65 | 90.14,38.94 85.52,34.31 85.52,30.23 85.88,29.87 86.41,29.87 86.94,30.4 86.94,30.76 IC2.5 | 101.7,43.2 100.64,44.27 99.57,44.27 | 99.57,44.27 99.21,43.92 99.21,42.49 96.37,39.65 | J7.GND 97.64,45 98.84,45 99.57,44.27
N$1
  Bottom 0.152: C8.1 17.25,34.31 16.18,35.38 8.53,35.38 4.45,31.29 4.45,16.89 8.18,13.16 12.09,13.16 12.98,12.27 POT1.P$3
N$2  (via drill 0.35)  (1 unrouted)
  Top 0.152: J8.2 120,37.9 120,43.5 115.12,48.38 113.61,48.38 112.99,49 v111,49
  Bottom 0.152: v111,49 109.88,49 109.05,49.83 108,49.83 107.59,49.83
N$3
  Bottom 0.152: R28.1 15.47,20.45 15.47,34.14 C8.2
N$5
  Top 0.152: J1.3 16.71,46.58 14.94,46.58 9.42,41.07 7.82,41.07 7.47,40.72 7.47,28.45 8,27.91 8,24.71 6.4,23.11 6.4,14.76 8.89,12.27 POT1.P$5
N$7  (via drill 0.35)
  Top 0.152: v114.86,29.34 114.86,28.8 117.17,26.49 117.17,18.67 v115.04,16.54
  Bottom 0.152: C15.1 108.1,9.07 111.12,9.07 R42.2 111.3,9.07 112.01,9.78 113.08,9.78 115.04,11.73 v115.04,16.54 | v114.86,29.34 113.97,30.23 IC4.1
N$8
  Bottom 0.152: C2.1 11.38,34.14 11.02,34.14 10.13,35.03 8.71,35.03 8,34.31 8,22.23 6.76,20.98 6.76,15.11 8.36,13.51 13.69,13.51 14.94,12.27 POT1.P$2
N$9
  Top 0.152: J1.2 9.25,39.29 9.6,39.29 13.69,35.2 J1.4 13.69,35.03 13.69,29.87 6.76,22.94 6.76,15.11 7.47,14.4 8.71,14.4 10.85,12.27 POT1.P$4
N$13
  Bottom 0.152: R27.1 9.42,20.45 9.42,33.96 C2.2
N$15  (via drill 0.35)
  Top 0.152: v116.46,25.6 114.68,25.6 113.44,26.85 113.08,26.85 POT14.2.3
  Bottom 0.152: IC4.13 112.55,35.56 112.55,35.03 113.97,33.6 116.46,33.6 R46.2 116.64,33.43 116.64,26.31 116.46,26.14 v116.46,25.6
N$16
  Top 0.152: J9.2 75.92,39.12 76.45,39.12 80.37,35.2 J9.4 80.54,35.03 84.28,31.29 91.75,31.29 105.61,17.42 107.21,17.42 111.84,12.8 POT13.P$2
N$17  (via drill 0.35)
  Top 0.152: v103.12,28.27 105.44,28.27 v105.79,28.63
  Bottom 0.152: R43.2 111.12,6.04 108.81,6.04 C16.1 108.64,5.87 108.28,5.87 107.39,4.98 105.97,4.98 103.12,7.82 v103.12,28.27 | v105.79,28.63 105.79,29.87 106.15,30.23 IC4.7
N$18
  Top 0.152: J9.3 83.57,46.58 81.61,46.58 76.45,41.43 74.32,41.43 73.97,41.07 73.97,36.63 82.32,28.27 94.23,28.27 108.64,13.87 108.81,13.87 109.88,12.8 POT13.P$3
N$19
  Bottom 0.152: R28.2 13.87,20.27 13.87,15.65 POT7.2.2
N$21  (via drill 0.35)
  Top 0.152: v117.53,17.96 117.53,17.25 118.59,16.18 J10.3
  Bottom 0.152: v117.53,17.96 117.53,20.8 119.13,22.4 119.13,38.94 116.81,41.25 116.81,42.32 C22.2
N$22
  Bottom 0.152: R30.1 31.29,20.45 31.29,24.89 26.49,29.69 26.49,34.14 C9.2
N$23  (via drill 0.35)
  Top 0.152: v101.35,40.54 101.35,28.98 106.5,23.82 107.21,23.82 | 107.21,23.82 111.3,23.82 J10.2 | 107.21,23.82 107.21,19.2 J10.4
  Bottom 0.152: v101.35,40.54 102.59,41.78 102.59,42.49 C21.2
N$24
  Bottom 0.152: C21.1 104.72,42.49 104.72,39.83 106.15,38.41 106.15,35.74 IC4.8 106.15,35.56 105.08,34.49 105.08,27.03 POT14.1.2
N$25  (via drill 0.35)
  Top 0.152: v115.75,24.89 113.44,24.89 111.48,26.85 111.12,26.85 POT14.2.2
  Bottom 0.152: 114.5,36.27 113.97,35.74 IC4.14 | 114.5,36.27 114.68,36.45 114.68,42.32 C22.1 | v115.75,24.89 116.81,24.89 117.35,25.43 117.35,34.31 115.39,36.27 114.5,36.27
N$26
  Top 0.152: J2.3 27.74,46.58 25.96,46.58 20.45,41.07 18.67,41.07 17.96,40.36 17.96,19.2 24.89,12.27 POT2.P$5
N$27
  Bottom 0.152: R29.2 23.82,20.27 23.82,15.65 POT8.1.2
N$28
  Bottom 0.152: C9.1 28.45,34.14 28.45,28.27 35.56,21.16 35.56,14.94 34.14,13.51 30.4,13.51 29.16,12.27 POT2.P$3
N$29
  Bottom 0.152: C3.1 22.58,34.14 24.54,34.14 25.78,35.38 28.98,35.38 30.23,34.14 30.23,27.03 35.92,21.34 35.92,14.76 34.31,13.16 32,13.16 31.11,12.27 POT2.P$2
N$30
  Top 0.152: J2.2 20.27,39.29 20.62,39.29 24.71,35.2 J2.4 24.71,35.03 24.71,25.78 22.76,23.82 22.76,15.11 23.47,14.4 24.71,14.4 26.85,12.27 POT2.P$4
N$31
  Bottom 0.152: R29.1 25.25,20.45 25.25,29.16 20.45,33.96 C3.2
N$32
  Bottom 0.152: R30.2 29.87,20.27 29.87,15.65 POT8.2.2
N$41
  Bottom 0.152: R32.1 47.47,20.45 47.47,20.8 48.01,21.34 48.01,23.65 37.52,34.14 C10.2
N$42
  Top 0.152: J3.3 38.76,46.58 36.8,46.58 31.29,41.07 29.69,41.07 29.52,40.89 29.52,22.4 36.98,14.94 38.23,14.94 40.89,12.27 POT3.P$5
N$43
  Bottom 0.152: R31.2 39.83,20.27 39.83,15.65 POT9.1.2
N$44
  Bottom 0.152: C10.1 39.47,34.14 39.47,32.72 53.16,19.02 53.16,16.18 50.14,13.16 46.05,13.16 45.16,12.27 POT3.P$3
N$45  (via drill 0.35)
  Top 0.152: v38.41,12.8 v36.98,14.22
  Bottom 0.152: v36.98,14.22 36.98,20.8 30.58,27.2 30.58,34.85 30.76,35.03 32.36,35.03 33.25,34.14 C4.1 | v38.41,12.8 40.18,11.02 45.87,11.02 46.94,12.09 POT3.P$2
N$46
  Top 0.152: J3.2 31.29,39.29 31.65,39.29 35.74,35.2 J3.4 35.92,35.03 40.01,30.94 40.01,27.38 51.21,16.18 51.21,15.11 50.49,14.4 45.16,14.4 43.03,12.27 POT3.P$4
N$47
  Bottom 0.152: R31.1 41.25,20.45 41.25,26.67 35.03,32.89 32.54,32.89 31.47,33.96 C4.2
N$48
  Bottom 0.152: R32.2 45.87,20.27 45.87,15.65 POT9.2.2
N$55
  Bottom 0.152: R27.2 7.82,20.27 7.82,15.65 POT7.1.2
N$58
  Bottom 0.152: R34.1 63.48,20.45 64.19,20.45 64.9,21.16 64.9,21.87 56.36,30.4 52.09,30.4 48.36,34.14 C11.2
N$59
  Top 0.152: J4.3 49.78,46.58 47.83,46.58 42.32,41.07 40.72,41.07 40.54,40.89 40.54,27.38 55.65,12.27 56.9,12.27 POT4.P$5
N$60
  Bottom 0.152: R33.2 55.83,20.27 55.83,15.65 POT10.1.2
N$61
  Bottom 0.152: R45.1 102.06,33.6 102.06,30.4 103.83,28.63 103.83,14.94 105.97,12.8 POT13.P$5 105.97,12.62 105.97,9.07 C15.2
N$62
  Bottom 0.152: C11.1 50.49,34.14 51.56,34.14 54.94,30.76 56.54,30.76 67.21,20.09 67.21,12.27 65.96,11.02 62.05,11.02 60.98,12.09 POT4.P$3
N$63
  Bottom 0.152: C5.1 44.27,34.14 43.38,35.03 41.78,35.03 41.43,34.67 41.43,31.29 54.76,17.96 54.76,15.11 56.72,13.16 62.05,13.16 62.94,12.27 POT4.P$2
N$64
  Top 0.152: J4.2 42.32,39.29 46.58,35.03 J4.4 46.76,35.03 48.9,35.03 56.01,27.91 56.01,26.49 63.12,19.38 63.83,19.38 67.21,16 67.21,15.11 66.5,14.4 61.16,14.4 59.03,12.27 POT4.P$4
N$65
  Bottom 0.152: R33.1 57.25,20.45 52.98,24.71 50.32,24.71 42.49,32.54 42.49,33.96 C5.2
N$66
  Bottom 0.152: R34.2 61.87,20.27 61.87,15.65 POT10.2.2
N$75
  Bottom 0.152: R36.1 79.3,20.45 72.01,27.74 72.01,27.91 68.1,31.83 61.7,31.83 59.38,34.14 C12.2
N$76
  Top 0.152: J5.3 60.81,46.58 58.85,46.58 53.34,41.07 51.74,41.07 51.56,40.89 51.56,32.89 60.81,23.65 60.81,22.23 63.3,19.74 65.43,19.74 72.9,12.27 POT5.P$5
N$77
  Bottom 0.152: R35.2 71.83,20.27 71.83,15.65 POT11.1.2
N$78
  Bottom 0.152: C12.1 61.52,34.14 62.59,34.14 64.54,32.18 71.12,32.18 83.57,19.74 83.57,14.94 81.79,13.16 78.05,13.16 77.17,12.27 POT5.P$3
N$79
  Bottom 0.152: C6.1 55.47,33.96 55.47,32.36 70.76,17.07 70.76,12.45 72.19,11.02 77.88,11.02 78.94,12.09 POT5.P$2
N$80
  Top 0.152: J5.2 53.16,39.29 53.52,39.29 57.61,35.2 J5.4 57.78,35.03 61.16,31.65 61.16,22.4 63.12,20.45 65.25,20.45 71.3,14.4 72.72,14.4 74.85,12.27 POT5.P$4
N$81
  Bottom 0.152: R35.1 73.25,20.45 68.99,24.71 66.32,24.71 56.36,34.67 56.36,34.85 56.19,35.03 54.41,35.03 53.52,34.14 C6.2
N$82
  Bottom 0.152: R36.2 77.88,20.27 77.88,15.65 POT11.2.2
N$91
  Bottom 0.152: R38.1 95.3,20.45 95.3,20.8 91.39,24.71 79.65,24.71 70.23,34.14 C13.2
N$92
  Top 0.152: J6.3 72.01,46.58 72.01,29.16 88.9,12.27 POT6.P$5
N$93
  Bottom 0.152: R37.2 87.83,20.27 87.83,15.65 POT12.1.2
N$94
  Bottom 0.152: C13.1 72.36,34.31 73.61,34.31 75.39,36.09 79.12,36.09 86.94,28.27 89.08,28.27 96.37,20.98 96.37,19.74 96.19,19.56 94.77,19.56 94.59,19.74 94.59,20.98 93.17,22.4 87.66,22.4 86.77,21.51 86.77,15.11 88.72,13.16 92.1,13.16 92.99,12.27 POT6.P$3
N$95  (via drill 0.35)
  Top 0.152: v67.56,32.89 67.56,32.36 v87.66,12.27
  Bottom 0.152: v67.56,32.89 66.5,33.96 C7.1 | v87.66,12.27 87.66,11.56 88.19,11.02 93.88,11.02 94.94,12.09 POT6.P$2
N$96
  Top 0.152: J6.2 64.19,39.29 64.54,39.29 68.63,35.2 J6.4 68.63,35.03 65.96,32.36 65.96,25.07 66.32,24.71 74.5,24.71 83.21,16 83.21,15.65 87.83,11.02 89.97,11.02 90.14,11.2 90.14,11.38 90.86,12.09 POT6.P$4
N$97  (via drill 0.35)
  Top 0.152: v82.68,21.69 v88.01,21.69
  Bottom 0.152: v88.01,21.69 89.26,20.45 R37.1 | v82.68,21.69 82.14,21.69 70.59,33.25 68.99,33.25 67.21,35.03 65.43,35.03 64.54,34.14 C7.2
N$98
  Bottom 0.152: R38.2 93.88,20.27 93.88,15.65 POT12.2.2
N$114
  Bottom 0.152: R1.1 100.46,39.47 101.35,39.47 103.83,41.96 103.83,43.38 105.44,44.98 109.7,44.98 113.97,49.25 LED1.A
N$115
  Bottom 0.152: D1.A 100.46,4.45 99.92,3.91 95.66,3.91 94.59,2.85 93.34,2.85 IC5.1 93.17,2.85 89.43,2.85 88.37,3.91 82.32,3.91 79.48,6.76 L1.P$2
N$116
  Bottom 0.152: 91.21,5.33 91.21,5.16 C18.1 91.21,5.33 | 91.21,5.33 91.21,8.71 R44.1 | 91.21,5.33 93.88,5.33 94.41,4.8 95.83,4.8 IC5.4
N$117
  Bottom 0.152: R47.1 46.05,2.13 46.05,4.98 50.49,9.42 65.79,9.42 67.21,8 R48.2 | C19.2 67.39,4.45 67.39,7.82 R48.2 | IC5.3 93.17,4.62 92.28,4.62 91.92,4.27 88.9,4.27 86.94,6.22 86.94,7.82 85.17,9.6 68.99,9.6 67.39,8 R48.2
N$118
  Bottom 0.152: R50.1 60.1,4.45 57.96,4.45 C24.2 57.78,4.62 56.01,6.4 55.83,6.4 | 55.83,6.4 53.7,6.4 IC6.2 | 55.83,6.4 57.61,8.18 R49.2
N$119  (via drill 0.35)
  Top 0.152: v50.32,5.69 50.32,4.62 51.21,3.73 v72.54,3.73
  Bottom 0.152: v50.32,5.69 49.25,5.69 IC6.6 | v72.54,3.73 74.68,3.73 75.39,4.45 C25.1
N$121
  Bottom 0.152: R39.1 98.32,43.38 90.86,43.38 87.66,46.58 LED2.K
N$122
  Bottom 0.152: R39.2 99.92,43.2 99.92,42.67 97.43,40.18 97.43,38.76 95.83,37.16 89.79,37.16 88.01,35.38 88.01,33.6 IC2.3
N$123
  Bottom 0.152: R40.2 94.77,39.29 94.06,39.29 92.28,37.52 89.61,37.52 86.23,34.14 86.23,33.6 IC2.1
N$124
  Bottom 0.152: R2.2 94.77,35.74 91.75,32.72 89.79,32.72 88.01,30.94 IC2.4
N$125  (via drill 0.35)
  Top 0.152: v94.59,33.07 92.46,33.07 85.52,40.01 v84.81,40.01 v82.68,37.87
  Bottom 0.152: v84.81,40.01 84.45,39.65 84.45,38.94 IC3.5 | v94.59,33.07 94.59,32.18 94.41,32 R41.2 | v82.68,37.87 74.32,37.87 71.48,35.03 71.48,33.43 71.65,33.25 73.08,33.25 73.97,34.14 75.56,34.14 C14.2
N$126
  Bottom 0.152: IC1.4 83.74,43.2 83.74,43.03 84.1,42.67 84.63,42.67 84.81,42.85 84.81,43.2 IC1.6
N$127
  Bottom 0.152: IC1.5 84.28,43.38 84.28,43.56 84.63,43.92 85.17,43.92 86.23,42.85 86.23,38.23 85.17,37.16 84.63,37.16 84.45,37.34 84.45,37.69 IC3.2
N$128
  Bottom 0.152: IC1.2 84.28,41.78 84.28,41.43 83.21,40.36 82.86,40.36 82.5,40.01 82.5,39.29 83.92,37.87 IC3.3
OUT-L  (via drill 0.35)
  Top 0.152: 104.9,9.07 102.06,9.07 97.08,14.05 91.57,14.05 90.14,15.47 POT12.1.1 | 104.9,9.07 v114.15,9.07 | 104.9,9.07 v104.9,15.11 | v47.3,21.69 51.56,21.69 57.61,15.65 57.96,15.65 POT10.1.1 | v62.59,22.05 63.83,20.8 68.45,20.8 73.61,15.65 73.97,15.65 POT11.1.1 74.14,15.47 75.21,14.4 80.72,14.4 82.14,12.98 v82.86,12.98
  Bottom 0.152: v114.15,9.07 113.08,9.07 R42.1 | v104.9,15.11 116.28,26.49 116.28,27.38 115.04,28.63 113.61,28.63 112.55,29.69 112.55,30.23 IC4.2 | 22.94,14.4 24.71,14.4 25.96,15.65 POT8.1.1 | 22.94,14.4 11.2,14.4 10.13,15.47 POT7.1.1 | 22.94,14.4 22.94,12.09 24,11.02 33.96,11.02 36.45,13.51 39.65,13.51 41.6,15.47 41.96,15.47 POT9.1.1 42.14,15.65 42.14,18.31 45.52,21.69 v47.3,21.69 | v62.59,22.05 61.34,22.05 58.14,18.85 58.14,15.65 POT10.1.1 | v82.86,12.98 85.17,10.67 97.61,10.67 98.15,11.2 98.15,12.98 97.61,13.51 92.1,13.51 90.14,15.47 POT12.1.1
OUT-L1  (via drill 0.35)
  Top 0.152: v104.37,34.67 107.21,34.67 114.86,27.03 POT14.1.3
  Bottom 0.152: v104.37,34.67 101.35,34.67 100.46,33.78 R45.2 | IC4.9 107.57,35.56 107.57,32.18 108.1,31.65 108.1,29.16 108.99,28.27 113.61,28.27 114.86,27.03 POT14.1.3
OUT-R  (via drill 0.35)
  Top 0.152: v52.45,16.54 53.34,16.54 55.47,14.4 58.85,14.4 59.92,15.47 POT10.2.1 | v23.65,12.45 22.94,13.16 14.76,13.16 12.45,15.47 12.09,15.47 POT7.2.1 | v34.85,18.14 41.07,18.14 43.56,15.65 43.92,15.65 POT9.2.1 | v101.7,10.49 101.17,10.49 97.26,14.4 93.17,14.4 92.1,15.47 POT12.2.1 91.92,15.65 88.19,19.38 v82.86,19.38 | v106.86,28.63 106.15,29.34 102.77,29.34 v102.41,28.98 | v64.19,21.51 70.05,21.51 75.92,15.65 POT11.2.1
  Bottom 0.152: v52.45,16.54 52.45,16.36 50.49,14.4 45.52,14.4 44.45,15.47 44.09,15.47 POT9.2.1 | v23.65,12.45 23.65,12.8 25.25,14.4 26.85,14.4 27.91,15.47 POT8.2.1 28.09,15.47 29.16,14.4 34.49,14.4 35.2,15.11 35.2,16 34.85,16.36 v34.85,18.14 | R43.1 112.72,6.04 111.3,4.62 105.79,4.62 101.7,8.71 v101.7,10.49 102.41,11.2 v102.41,28.98 | v106.86,28.63 107.39,29.16 107.39,30.23 IC4.6 | v82.86,19.38 83.21,19.02 83.21,15.11 82.5,14.4 77.52,14.4 76.45,15.47 76.1,15.47 POT11.2.1 | v64.19,21.51 64.01,21.34 61.16,21.34 60.1,20.27 60.1,15.65 POT10.2.1
OUT-R1
  Bottom 0.152: R46.1 118.06,33.43 118.06,22.58 109.35,13.87 109.17,13.87 108.1,12.8 POT13.P$4 107.92,12.62 106.86,11.56 106.86,6.04 C16.2
V+  (via drill 0.35)
  Top 0.152: v51.03,4.98 51.56,5.51 v68.1,5.51 96.37,5.51 v99.21,8.36 | 90.14,45 90.14,46.76 87.66,49.25 LED2.A | 90.14,45 v90.14,36.45 92.28,36.45 v95.66,33.07 | v93,45 90.14,45
  Bottom 0.152: C26.1 75.21,8 71.65,4.45 69.16,4.45 C19.1 68.99,4.45 68.1,5.33 v68.1,5.51 | 48.54,5.16 49.07,5.16 IC6.5 49.25,4.98 v51.03,4.98 | 48.54,5.16 48.36,5.33 48.36,6.76 48.54,6.93 49.07,6.93 IC6.8 | C20.1 44.45,4.8 44.45,2.13 R47.2 44.45,1.96 45.16,1.25 46.76,1.25 48.54,3.02 48.54,5.16 | C1.1 90.86,39.47 90.86,41.96 86.41,46.41 86.41,48.18 87.48,49.25 LED2.A | v90.14,36.45 90.14,33.6 88.72,32.18 86.94,32.18 86.23,31.47 86.23,30.94 IC2.6 | v95.66,33.07 95.66,27.38 100.46,22.58 100.46,8.89 D1.C 100.46,8.71 100.1,8.36 v99.21,8.36 | J7.VBUS 93.68,45.68 v93,45
VBAT  (via drill 0.35)
  Top 0.152: v88.01,8.71 v86.23,6.93 | v88.9,33.43 v90.32,32 95.66,32 96.37,32.72 96.37,36.63 100.99,41.25 103.83,41.25 110.41,47.83 114.33,47.83 118.59,43.56 118.59,37.52 120.37,35.74 120.37,34.67 J8.1
  Bottom 0.152: 98.5,7.64 97.26,7.64 96.01,8.89 C17.1 95.83,9.07 94.94,9.96 90.68,9.96 89.61,8.89 R44.2 89.43,8.71 v88.01,8.71 | 98.5,7.64 99.21,7.64 101.7,5.16 101.7,3.91 101.35,3.56 97.26,3.56 96.55,2.85 96.01,2.85 IC5.5 | v86.23,6.93 83.92,6.93 L1.P$1 | R41.1 92.81,32 92.81,32.36 98.5,38.05 98.5,39.29 R1.2 | v88.9,33.43 88.9,33.07 88.37,32.54 87.66,32.54 87.12,33.07 87.12,33.43 IC2.2 | v90.32,32 92.63,32 R41.1 | 98.5,7.64 98.5,14.4 99.21,15.11 99.21,23.29 92.81,29.69 92.81,31.83 R41.1
VGND
  Bottom 0.152: R52.2 112.37,42.32 112.37,37.34 111.3,36.27 111.3,35.74 IC4.12 111.3,35.56 111.3,30.4 IC4.3 111.12,30.23 111.12,29.69 110.41,28.98 109.53,28.98 108.81,29.69 108.81,30.23 IC4.5 108.81,30.4 108.81,35.56 IC4.10 108.64,35.74 108.64,42.32 R51.1

### Text on the board
tNames: Analog-Mixer-OPA4134-L / 2018 Ali Momeni @ Pittsburgh